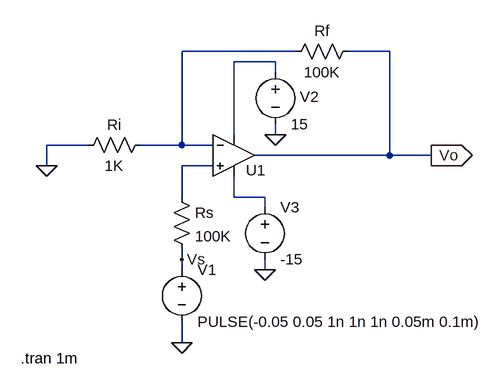
[diagram p0: schematic Run_3_B.asc]
Run_3_B.asc, the LTspice schematic file:
Version 4
SHEET 1 880 680
WIRE 272 -64 96 -64
WIRE 416 -64 352 -64
WIRE 240 -48 176 -48
WIRE 240 -32 240 -48
WIRE 176 64 176 -48
WIRE 240 64 240 48
WIRE -48 80 -112 80
WIRE 96 80 96 -64
WIRE 96 80 32 80
WIRE 144 80 96 80
WIRE 416 96 416 -64
WIRE 416 96 208 96
WIRE 480 96 416 96
WIRE -112 112 -112 80
WIRE 144 112 96 112
WIRE 96 160 96 112
WIRE 176 160 176 128
WIRE 224 160 176 160
WIRE 224 176 224 160
WIRE 96 256 96 240
WIRE 96 272 96 256
WIRE 224 272 224 256
WIRE 96 384 96 352
FLAG 480 96 Vo
IOPIN 480 96 Out
FLAG 96 384 0
FLAG -112 112 0
FLAG 96 256 Vs
FLAG 240 64 0
FLAG 224 272 0
SYMBOL res 48 64 R90
WINDOW 0 0 56 VBottom 2
WINDOW 3 32 56 VTop 2
SYMATTR InstName Ri
SYMATTR Value 1K
SYMBOL OpAmps\\UniversalOpamp2 176 96 R0
WINDOW 0 19 23 Left 2
SYMATTR InstName U1
SYMBOL res 368 -80 R90
WINDOW 0 0 56 VBottom 2
WINDOW 3 32 56 VTop 2
SYMATTR InstName Rf
SYMATTR Value 100K
SYMBOL res 80 144 R0
SYMATTR InstName Rs
SYMATTR Value 100K
SYMBOL voltage 96 256 R0
WINDOW 123 0 0 Left 0
WINDOW 39 0 0 Left 0
SYMATTR InstName V1
SYMATTR Value PULSE(-0.05 0.05 1n 1n 1n 0.05m 0.1m)
SYMBOL voltage 240 -48 R0
WINDOW 0 38 54 Left 2
WINDOW 123 0 0 Left 0
WINDOW 39 0 0 Left 0
SYMATTR InstName V2
SYMATTR Value 15
SYMBOL voltage 224 160 R0
WINDOW 123 0 0 Left 0
WINDOW 39 0 0 Left 0
SYMATTR InstName V3
SYMATTR Value -15
TEXT -152 408 Left 2 !.tran 1m

The netlist it stands for:
* Run_3_B.asc
Ri N001 0 1K
XU1 N003 N001 N002 N004 Vo level.2 Avol=1Meg GBW=10Meg Slew=10Meg ilimit=25m rail=0 Vos=0 phimargin=45 en=0 enk=0 in=0 ink=0 Rin=500Meg  ; pins IN+ IN- V+ V- OUT
Rf Vo N001 100K
Rs N003 Vs 100K
V1 Vs 0 PULSE(-0.05 0.05 1n 1n 1n 0.05m 0.1m)
V2 N002 0 15
V3 N004 0 -15
.tran 1m
.lib UniversalOpamps2.sub
.backanno
.end